# Altium schematic sheet BAT.SchDoc
size A; SheetNumber: 4; SheetTotal: 6
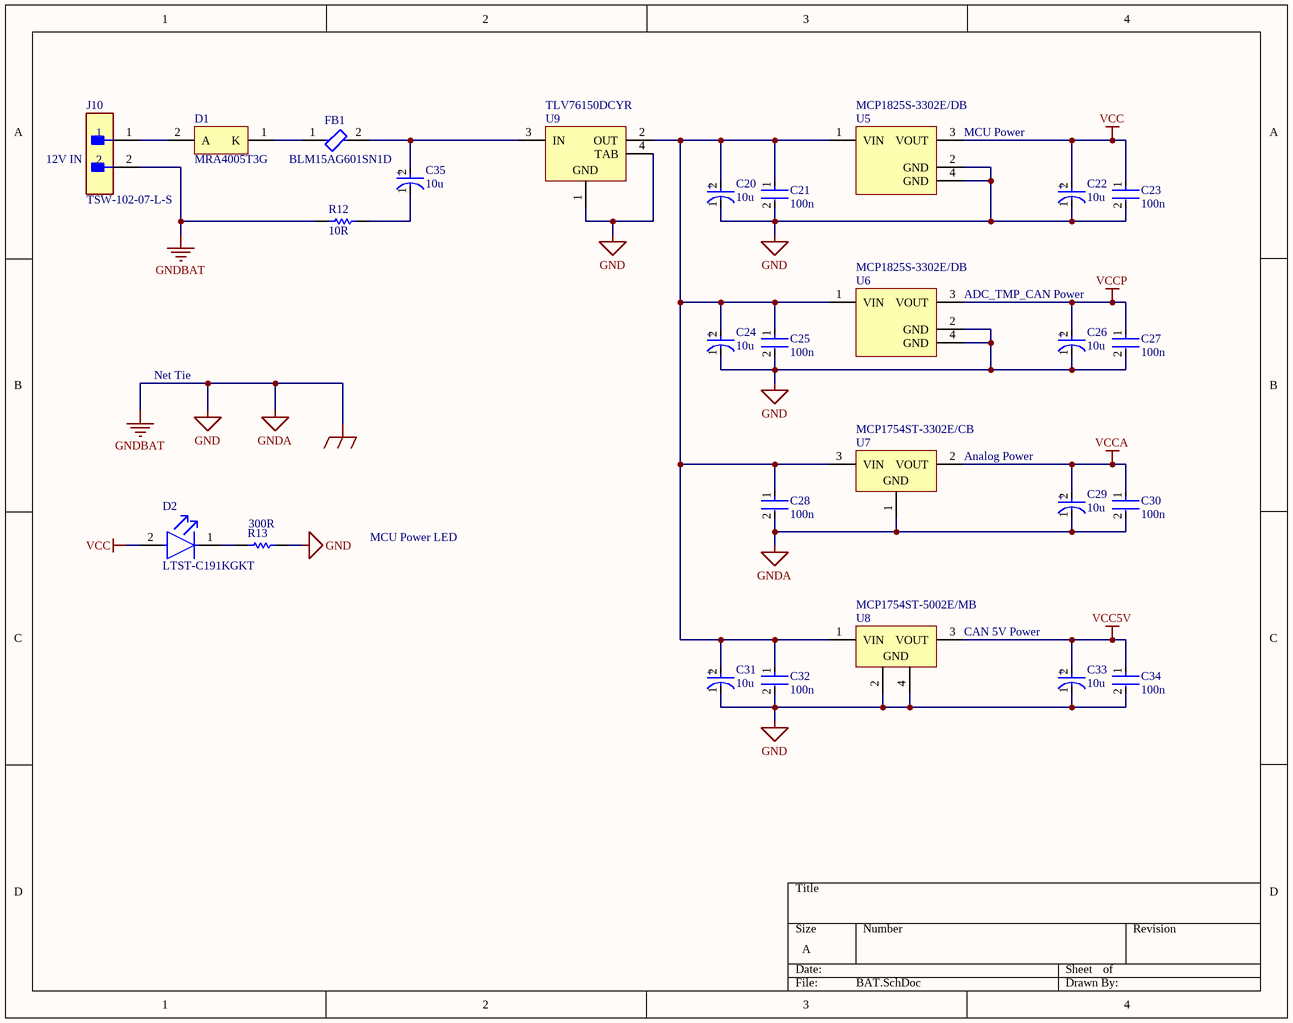
[diagram p0: BAT.SchDoc]

## Parts
C20  10u  [FP-TAJA-MFG]
C21  100n  [FP-GRM033-0_03-MFG]
C22  10u  [FP-TAJA-MFG]
C23  100n  [FP-GRM033-0_03-MFG]
C24  10u  [FP-TAJA-MFG]
C25  100n  [FP-GRM033-0_03-MFG]
C26  10u  [FP-TAJA-MFG]
C27  100n  [FP-GRM033-0_03-MFG]
C28  100n  [FP-GRM033-0_03-MFG]
C29  10u  [FP-TAJA-MFG]
C30  100n  [FP-GRM033-0_03-MFG]
C31  10u  [FP-TAJA-MFG]
C32  100n  [FP-GRM033-0_03-MFG]
C33  10u  [FP-TAJA-MFG]
C34  100n  [FP-GRM033-0_03-MFG]
C35  10u  [FP-TAJA-MFG]
D1  MRA4005T3G  [ONSC-SMA-2-403D-02_V]
D2  LTST-C191KGKT  [FP-LTST-C191KSKT-MFG]
FB1  BLM15AG601SN1D  [FP-BLM15-0_05-MFG]
J10  TSW-102-07-L-S  [FP-TSW-102-07-L-S-MFG]
R12  10R  [RESC2013X60X35ML10T20]
R13  300R  [RESC1608X55X30LL20T20]
U5  MCP1825S-3302E/DB  [SOT-223-DB3_N]
U6  MCP1825S-3302E/DB  [SOT-223-DB3_N]
U7  MCP1754ST-3302E/CB  [MCHP-SOT-23A-CB3_N]
U8  MCP1754ST-5002E/MB  [MCHP-SOT-89-MB3_L]
U9  TLV76150DCYR  [DCY0004A_L]

## Nets
GND: C20.1(C) C21.2 C22.1(C) C23.2 C24.1(C) C25.2 C26.1(C) C27.2 C28.2 C29.1(C) C30.2 C31.1(C) C32.2 C33.1(C) C34.2 J10.2 R12.1 R13.2 U5.2(GND) U5.4(GND) U6.2(GND) U6.4(GND) U7.1(GND) U8.2(GND) U8.4(GND) U9.1(GND) U9.4(TAB)  [also labelled GNDA, GNDBAT]
VCC: C22.2(A) C23.1 D2.2(A) U5.3(VOUT)
VCC5V: C33.2(A) C34.1 U8.3(VOUT)
VCCA: C29.2(A) C30.1 U7.2(VOUT)
VCCP: C26.2(A) C27.1 U6.3(VOUT)
NetC20_2: C20.2(A) C21.1 C24.2(A) C25.1 C28.1 C31.2(A) C32.1 U5.1(VIN) U6.1(VIN) U7.3(VIN) U8.1(VIN) U9.2(OUT)
NetC35_1: C35.1(C) R12.2
NetC35_2: C35.2(A) FB1.2 U9.3(IN)
NetD1_1: D1.1(K) FB1.1
NetD1_2: D1.2(A) J10.1
NetD2_1: D2.1(C) R13.1

## Notes on the sheet
- (near J10) 12V IN
- (near U5) MCU Power
- ADC_TMP_CAN Power
- Net Tie
- (near U7) Analog Power
- MCU Power LED
- (near U8) CAN 5V Power
- (in symbol CMP-04424-000097-1) +

## Library data of the parts
C20 C22 C24 C26 C29 C31 C33 C35 = CMP-04424-000097-1: 10uF 6.3V  ±10% 4Ω 1206  SMD Tantalum Capacitor; Leakage Current: 600nA; Q Factor: 6; Polarity: Polar; ESR (Equivalent Series Resistance): 4R; Dissipation Factor: 6%; Tolerance: 20%; Lead Free: Lead Free; Min Operating Temperature: -55°C; Case/Package: 1206; Voltage Rating (DC): 6.3V; Capacitance: 10uF; Mount: Surface Mount; Termination: SMD/SMT; Depth: 1.6mm; Height: 1.6mm; Voltage: 6.3V; Features: General Purpose; Series: TAJ; Voltage Rating: 6.3V; Package Quantity: 1; Max Operating Temperature: 125°C; Width: 1.6mm; Length: 3.2mm; Construction: Flat; REACH SVHC: No SVHC; Case Code (Imperial): 1206; Radiation Hardening: No; RoHS Compliant: Yes; Dielectric Material: Tantalum; Height - Seated (Max): 0.071inch; Case Code (Metric): 3216; Packaging: Tape and Reel
C21 C23 C25 C27 C28 C30 C32 C34 = CMP-06035-000062-2: Chip Multilayer Ceramic Capacitors for General Purpose, 0201, 0.10uF, X5R, 15%, 10%, 6.3V; Capacitance: 100nF; Min Operating Temperature: -55°C; Lead Free: Lead Free; Radiation Hardening: No; Dielectric: X5R; Voltage Rating (DC): 6.3V; REACH SVHC: No SVHC; Case/Package: 0201; Voltage Rating: 6.3V; Length: 0.6mm; Max Operating Temperature: 85°C; Width: 0.012inch; Depth: 0.3mm; Material: Ceramic; Case Code (Metric): 0603; Thickness: 0.013inch; Packaging: Tape and Reel; Height: 0.3mm; Weight: 6E-06oz; Package Quantity: 1; Mount: Surface Mount; Voltage: 6.3V; Case Code (Imperial): 0201; Tolerance: 10%; Termination: SMD/SMT
D1 = CMP-0894-00001-3: Surface Mount Standard Recovery Power Rectifier, 2-Pin SMA, Pb-Free, Tape and Reel; Manufacturer: On Semiconductor; VRRM Max (V): 600; IFSM Max (A): 30; IO(rec) Max (A): 1; RoHS: TRUE; PackageDescription: 2-Pin Small Molded Package, J-Bend Lead, Body 2.605 x 4.315 mm; ComponentLink1Description: Manufacturer URL; ComponentLink2Description: Datasheet; Packing: Tape and Reel; ComponentLink2URL: http://www.onsemi.com/pub_link/Collateral/MRA4003T3-D.PDF; DatasheetVersion: Rev. 9; ComponentLink3Description: Package Specification; Mounting Technology: Surface Mount; PackageReference: SMA-2-403D-02; ComponentLink1URL: http://www.onsemi.com/; ComponentLink3URL: http://www.onsemi.com/pub_link/Collateral/403D-02.PDF; PackageVersion: Rev. G, 07/2012; Type: Standard Recovery; PartNumber: MRA4005T3G
D2 = CMP-22017-000025-1: LED YELLOW CLEAR SMD; Dominant Wavelength: 597nm; Power Rating: 75mW; Number of LEDs: 1; Lens Style: Diffused; Forward Current: 30mA; Test Current: 20mA; Forward Voltage: 2.4V; Wavelength: 588nm; Viewing Angle: 130°; Lens Color: Colorless; Reverse Voltage: 5V; Luminous Intensity: 180mcd; Case Code (Imperial): 0603; Width: 0.8mm; Power Dissipation: 75mW; Length: 1.6mm; Illumination Color: Yellow; Number of Pins: 2; Case Code (Metric): 1608; Mount: Surface Mount; Number of Elements: 1; Height: 0.55mm; Lens Transparency: Clear; Depth: 0.8mm; Min Operating Temperature: -55°C; Case/Package: 0603; Radiation Hardening: No; Max Operating Temperature: 85°C; Package Quantity: 1; Packaging: Tape and Reel; Lead Free: Lead Free; Color: Yellow
FB1 = CMP-0686-00187-4: Chip Ferrite Bead, 0402, 600Ω @ 100MHz, 0.52Ω, 25%, 300mA; DC Resistance-Max: 600mR; Number of Lines: 1; DC Resistance (DCR): 520mR; Shielding: Unshielded; Impedance: 600R; Material: Steel; Frequency: 100MHz; Lead Free: Lead Free; Max DC Current: 300mA; Test Frequency: 100MHz; Depth: 0.55mm; Length: 1mm; Case Code (Imperial): 0402; Packaging: Tape and Reel; Height: 0.5mm; Max Operating Temperature: 125°C; Military Standard: Not; REACH SVHC: No SVHC; Case Code (Metric): 1005; Series: BLM15AG_SN; Core Material: Ferrite; Termination: SMD/SMT; DC Current: 300mA; Package Quantity: 10000; Width: 0.5mm; RoHS Compliant: Yes; Min Operating Temperature: -55°C; Current Rating: 300mA; Case/Package: 0402; Number of Pins: 2; Radiation Hardening: No; Tolerance: 25%; Number of Circuits: 1; Max Current Rating: 300mA
J10 = CMP-02766-001428-1: CONN HEADER VERT 2POS 2.54MM; Voltage Rating: 550V; Current Rating: 7.6A; Gender: Male; Number of Contacts: 2; Connector Type: Male Pin; Radiation Hardening: No; Orientation: Straight; Contact Plating: Gold; Max Operating Temperature: 125°C; Mount: Through Hole; Package Quantity: 1; Number of Rows: 1; Housing Material: Polyester; RoHS Compliant: Yes; Length: 5.08mm; Max Voltage Rating (AC): 550V; Pitch: 2.54mm; Packaging: Bulk; Depth: 2.54mm; Termination: Solder; Min Operating Temperature: -55°C; Housing Color: Black; Lead Free: Lead Free; Color: Black; Number of Positions: 2; Width: 2.54mm; Max Current Rating: 7.6A; REACH SVHC: No SVHC; Contact Material: Bronze; Contact Mating Length: 0.23inch; Series: TSW; Contact Type: Male Pin
R12 = CMP-2100-03670-1: Chip Resistor, 10 Ohm, +/- 1%, 0.125 W, -55 to 155 degC, 0805 (2012 Metric), RoHS, Tape and Reel; Manufacturer: Yageo; Resistance: 10Ohm; Power Rating: 125mW; Voltage Rating: 150V; Temperature Coefficient: 200ppm/degreesC; Number of Pins: 2; REACH SVHC: NoSVHC; Datasheet Version: Rev. 5, 10/2016; Max Operating Temperature: 155degC; Manufacturer URL: http://www.yageo.com/; Case Code (Imperial): 0805; Package Description: 2-Pin Surface Mounted Device, Body 2 x 1.25 mm; Case Code (Metric): 2012; Length: 2mm; RoHSCompliant: true; Max Power Dissipation: 125mW; Depth: 1.25mm; Packaging: TapeandReel; Height: 0.5mm; Package Reference: 0805; Package Quantity: 1; Tolerance: 1%; Termination: SMD/SMT; Min Operating Temperature: -55degC; Lead Free: LeadFree; Width: 1.25mm; Voltage Rating (DC): 150V; Datasheet URL: http://www.yageo.com/NewPortal/yageodocoutput?fileName=/pdf/R-Chip/PYu-RC_Group_51_RoHS_L_5.pdf; Composition: ThickFilm; Number of Terminations: 2; Case/Package: 0805
R13 = CMP-2000-00025-1: Part Number: ERA3AEB301V; Manufacturer: Panasonic
U5 U6 = CMP-0136-00458-1: 500 mA, Low Voltage, Low Quiescent Current LDO Regulator, 3-Pin SOT-223, Extended Temperature; PackageReference: SOT-223-DB3; PackageDescription: 3-Lead Plastic Small Outline Transistor (DB) [SOT-223]; PackageVersion: revBB, Aug-2009; DatasheetVersion: revB, Feb-2008
U7 = CMP-0136-01141-1: 150 mA, 16 V, High Performance LDO, -40 to 125 degC, 3-pin SOT-23A (CB3), Tape and Reel; Manufacturer: Microchip; ComponentLink1Description: Manufacturer URL; PackageVersion: C04-130B; ComponentLink1URL: http://www.microchip.com; ComponentLink3Description: Package Specification; ComponentLink4URL: http://www.microchip.com/MCP1754S; ComponentLink2URL: http://ww1.microchip.com/downloads/en/DeviceDoc/22276A.pdf; ComponentLink2Description: Datasheet; PackageDescription: 3-Lead Plastic Small Outline Transistor, 2.9 x 1.5 mm Body, 0.95 mm Pitch; ComponentLink3URL: http://www.microchip.com/stellent/groups/techpub_sg/documents/packagingspec/en012702.pdf; ComponentLink4Description: Product URL; PackageReference: SOT-23A-CB3; Mounting Technology: Surface Mount; PartNumber: MCP1754ST-3302E/CB; DatasheetVersion: Rev. A
U8 = CMP-0136-01167-1: 150 mA, 16 V, High Performance LDO, -40 to 125 degC, 3-pin SOT-89 (MB3), Tape and Reel; Manufacturer: Microchip; PartNumber: MCP1754ST-5002E/MB; PackageDescription: 3-Lead Plastic Small Outline Transistor Header, 4.5 x 2.45 mm Body, 1.5 mm Pitch; Mounting Technology: Surface Mount; ComponentLink3Description: Package Specification; PackageVersion: C04-029B; ComponentLink4Description: Product URL; ComponentLink2Description: Datasheet; ComponentLink3URL: http://www.microchip.com/stellent/groups/techpub_sg/documents/packagingspec/en012702.pdf; PackageReference: SOT-89-MB3; ComponentLink2URL: http://ww1.microchip.com/downloads/en/DeviceDoc/22276A.pdf; ComponentLink1Description: Manufacturer URL; ComponentLink1URL: http://www.microchip.com; ComponentLink4URL: http://www.microchip.com/MCP1754S; DatasheetVersion: Rev. A
U9 = CMP-0062-01637-4: 800mA Low-Dropout Linear Regulator, 4-pin SOT-223; PartNumber: LM1117MPX-5.0; Manufacturer: Texas Instruments; High-Reliability: Y; PowerWise: N; PackageTopMarking: XYTT*N06A; CompType: LDO IC; PackageDescription: Molded SOT-223, 6.50 x 3.56 x 1.6mm Body, 4 Lead, 2.3mm Pitch; PackageReference: DCY0004A; ComponentLink1URL: http://www.ti.com/general/docs/lit/getliterature.tsp?genericPartNumber=LM1117-N&fileType=pdf; Code_JEDEC: TO-261-AA; ComponentLink1Description: Datasheet URL; Code_IPC: SOT223-4; RoHS: N; PinCount: 4